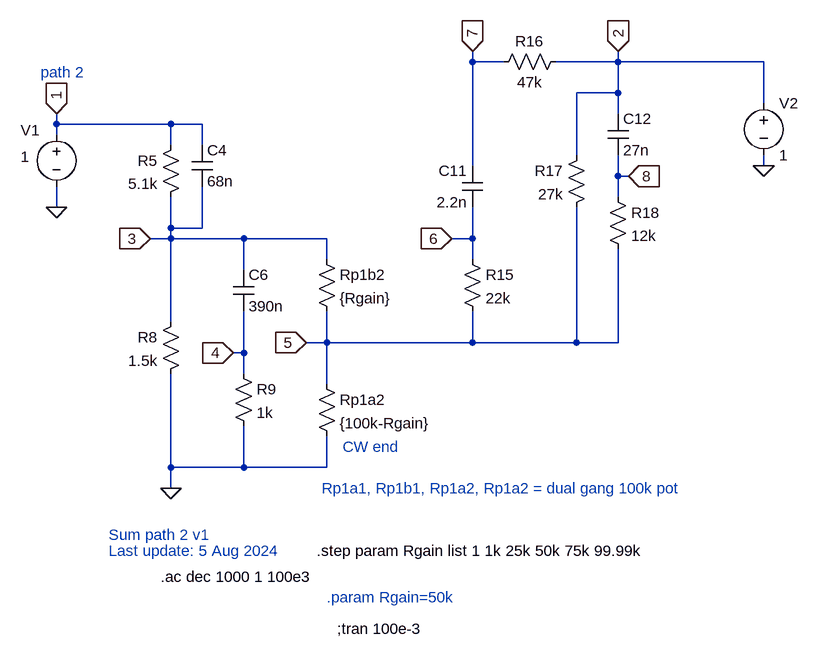
[diagram p0: schematic Klon-Centaur_sum_path2_v1.asc]
Klon-Centaur_sum_path2_v1.asc, the LTspice schematic file:
Version 4
SHEET 1 4496 5064
WIRE 256 2544 256 2528
WIRE 304 2544 256 2544
WIRE 480 2544 480 2528
WIRE 480 2544 384 2544
WIRE 704 2544 480 2544
WIRE 480 2592 480 2544
WIRE 480 2592 416 2592
WIRE 704 2608 704 2544
WIRE 480 2624 480 2592
WIRE -384 2640 -384 2624
WIRE -208 2640 -384 2640
WIRE -160 2640 -208 2640
WIRE -384 2656 -384 2640
WIRE -208 2672 -208 2640
WIRE -160 2672 -160 2640
WIRE 416 2688 416 2592
WIRE 256 2704 256 2544
WIRE 704 2704 704 2688
WIRE 480 2720 480 2688
WIRE 496 2720 480 2720
WIRE 480 2752 480 2720
WIRE -384 2768 -384 2736
WIRE -208 2800 -208 2752
WIRE -160 2800 -160 2736
WIRE -160 2800 -208 2800
WIRE -208 2816 -208 2800
WIRE -208 2816 -240 2816
WIRE -96 2816 -208 2816
WIRE 32 2816 -96 2816
WIRE 256 2816 256 2768
WIRE 256 2816 224 2816
WIRE 32 2848 32 2816
WIRE 256 2848 256 2816
WIRE -96 2864 -96 2816
WIRE -208 2944 -208 2816
WIRE 32 2976 32 2928
WIRE 32 2976 0 2976
WIRE 256 2976 256 2928
WIRE 256 2976 32 2976
WIRE 416 2976 416 2768
WIRE 416 2976 256 2976
WIRE 480 2976 480 2832
WIRE 480 2976 416 2976
WIRE -96 2992 -96 2928
WIRE -96 2992 -112 2992
WIRE -96 3024 -96 2992
WIRE 32 3040 32 2976
WIRE -208 3168 -208 3024
WIRE -96 3168 -96 3104
WIRE -96 3168 -208 3168
WIRE 32 3168 32 3120
WIRE 32 3168 -96 3168
WIRE -208 3200 -208 3168
FLAG -208 3200 0
FLAG 256 2528 7
IOPIN 256 2528 In
FLAG 224 2816 6
IOPIN 224 2816 In
FLAG 496 2720 8
IOPIN 496 2720 In
FLAG 0 2976 5
IOPIN 0 2976 In
FLAG -112 2992 4
IOPIN -112 2992 In
FLAG -240 2816 3
IOPIN -240 2816 In
FLAG -384 2624 1
IOPIN -384 2624 In
FLAG -384 2768 0
FLAG 704 2704 0
FLAG 480 2528 2
IOPIN 480 2528 In
SYMBOL res -192 2656 M0
SYMATTR InstName R5
SYMATTR Value 5.1k
SYMBOL res -192 2928 M0
SYMATTR InstName R8
SYMATTR Value 1.5k
SYMBOL cap -176 2672 R0
SYMATTR InstName C4
SYMATTR Value 68n
SYMBOL cap -112 2864 R0
SYMATTR InstName C6
SYMATTR Value 390n
SYMBOL res -112 3008 R0
SYMATTR InstName R9
SYMATTR Value 1k
SYMBOL res 16 2832 R0
SYMATTR InstName Rp1b2
SYMATTR Value {Rgain}
SYMBOL res 16 3024 R0
SYMATTR InstName Rp1a2
SYMATTR Value {100k-Rgain}
SYMBOL cap 272 2704 M0
SYMATTR InstName C11
SYMATTR Value 2.2n
SYMBOL res 240 2832 R0
SYMATTR InstName R15
SYMATTR Value 22k
SYMBOL res 432 2672 M0
SYMATTR InstName R17
SYMATTR Value 27k
SYMBOL res 464 2736 R0
SYMATTR InstName R18
SYMATTR Value 12k
SYMBOL cap 464 2624 R0
SYMATTR InstName C12
SYMATTR Value 27n
SYMBOL res 400 2528 R90
WINDOW 0 0 56 VBottom 2
WINDOW 3 32 56 VTop 2
SYMATTR InstName R16
SYMATTR Value 47k
SYMBOL voltage -384 2640 R0
WINDOW 0 -55 9 Left 2
WINDOW 39 0 0 Left 0
WINDOW 3 -55 50 Left 2
SYMATTR InstName V1
SYMATTR Value 1
SYMBOL voltage 704 2592 R0
WINDOW 123 0 0 Left 0
WINDOW 39 0 0 Left 0
SYMATTR InstName V2
SYMATTR Value 1
TEXT -224 3336 Left 2 !.ac dec 1000 1 100e3
TEXT 56 3136 Left 2 ;CW end
TEXT 16 3296 Left 2 !.step param Rgain list 1 1k 25k 50k 75k 99.99k
TEXT 24 3200 Left 2 ;Rp1a1, Rp1b1, Rp1a2, Rp1a2 = dual gang 100k pot
TEXT 48 3416 Left 2 !;tran 100e-3
TEXT 32 3368 Left 2 ;.param Rgain=50k
TEXT -304 3272 Left 2 ;Sum path 2 v1
TEXT -408 2560 Left 2 ;path 2
TEXT -304 3296 Left 2 ;Last update: 5 Aug 2024

The netlist it stands for:
* Klon-Centaur_sum_path2_v1.asc
R5 1 3 5.1k
R8 3 0 1.5k
C4 1 3 68n
C6 3 4 390n
R9 4 0 1k
Rp1b2 3 5 {Rgain}
Rp1a2 5 0 {100k-Rgain}
C11 7 6 2.2n
R15 6 5 22k
R17 2 5 27k
R18 8 5 12k
C12 2 8 27n
R16 2 7 47k
V1 1 0 1
V2 2 0 1
.ac dec 1000 1 100e3
* CW end
.step param Rgain list 1 1k 25k 50k 75k 99.99k
* Rp1a1, Rp1b1, Rp1a2, Rp1a2 = dual gang 100k pot
;tran 100e-3
* .param Rgain=50k
* Sum path 2 v1
* path 2
* Last update: 5 Aug 2024
.backanno
.end